# Altium schematic sheet LCD.SchDoc
size A4
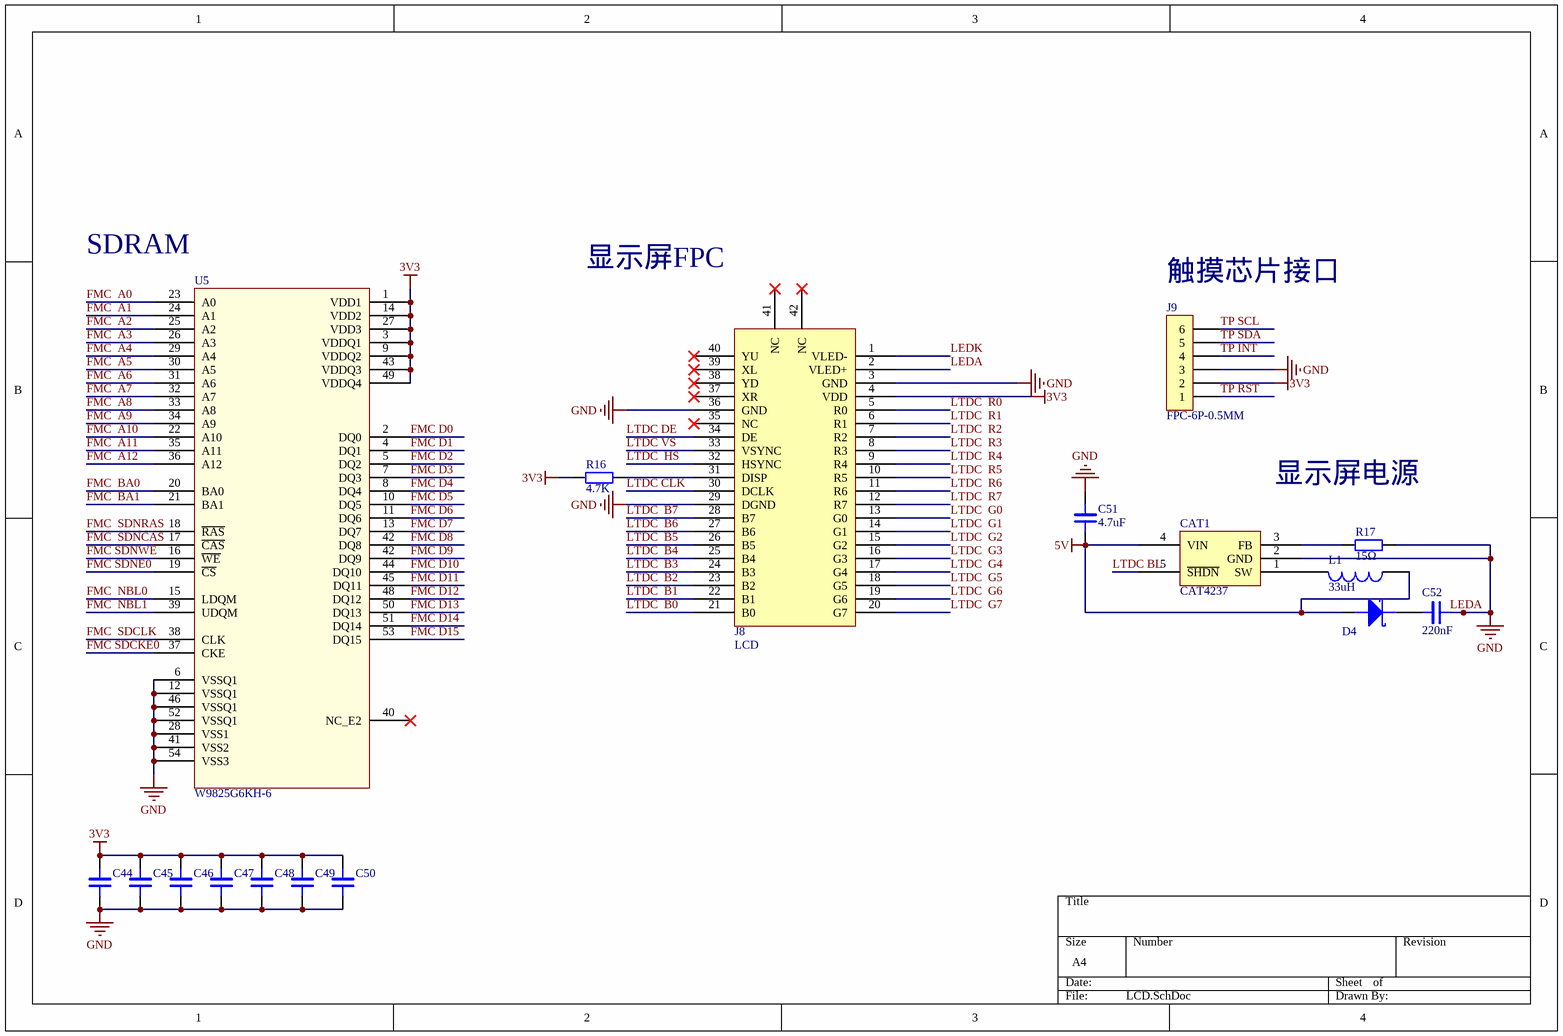
[diagram p0: LCD.SchDoc]

## Parts
C44  100nF 16V  [0805]  (value not drawn)
C45  100nF 16V  [0805]  (value not drawn)
C46  100nF 16V  [0805]  (value not drawn)
C47  100nF 16V  [0805]  (value not drawn)
C48  100nF 16V  [0805]  (value not drawn)
C49  100nF 16V  [0805]  (value not drawn)
C50  100nF 16V  [0805]  (value not drawn)
C51  4.7uF  [CAP-1812]
C52  220nF  [CAP-1812]
CAT1  CAT4237  [SOT-23-5]
D4  (no value)  [DO-15]
J8  LCD
J9  FPC-6P-0.5MM  [Pin HDR1X6/2.54mm-S]
L1  33uH  [AL0204]
R16  4.7K  [0805]
R17  15Ω  [0805]
U5  W9825G6KH-6

## Nets
3V3: C44.2 C45.2 C46.2 C47.2 C48.2 C49.2 C50.2 J8.4(VDD) J9.2 R16.1 U5.1(VDD1) U5.3(VDDQ1) U5.9(VDDQ2) U5.14(VDD2) U5.27(VDD3) U5.43(VDDQ3) U5.49(VDDQ4)
5V: C51.1 CAT1.4(VIN) D4.A L1.1
LEDA: C44.1 C45.1 C46.1 C47.1 C48.1 C49.1 C50.1 C51.2 C52.2 CAT1.2(GND) J8.2(VLED+) J8.3(GND) J8.29(DGND) J8.36(GND) J9.3 R17.2 U5.6(VSSQ1) U5.12(VSSQ1) U5.28(VSS1) U5.41(VSS2) U5.46(VSSQ1) U5.52(VSSQ1) U5.54(VSS3)  [also labelled GND]
FMC  A0: U5.23(A0)
FMC  A1: U5.24(A1)
FMC  A2: U5.25(A2)
FMC  A3: U5.26(A3)
FMC  A4: U5.29(A4)
FMC  A5: U5.30(A5)
FMC  A6: U5.31(A6)
FMC  A7: U5.32(A7)
FMC  A8: U5.33(A8)
FMC  A9: U5.34(A9)
FMC  A10: U5.22(A10)
FMC  A11: U5.35(A11)
FMC  A12: U5.36(A12)
FMC  BA0: U5.20(BA0)
FMC  BA1: U5.21(BA1)
FMC  NBL0: U5.15(LDQM)
FMC  NBL1: U5.39(UDQM)
FMC  SDCLK: U5.38(CLK)
FMC  SDNCAS: U5.17(~{CAS})
FMC  SDNRAS: U5.18(~{RAS})
FMC D0: U5.2(DQ0)
FMC D1: U5.4(DQ1)
FMC D2: U5.5(DQ2)
FMC D3: U5.7(DQ3)
FMC D4: U5.8(DQ4)
FMC D5: U5.10(DQ5)
FMC D6: U5.11(DQ6)
FMC D7: U5.13(DQ7)
FMC D8: U5.42(DQ8)
FMC D9: U5.42(DQ9)
FMC D10: U5.44(DQ10)
FMC D11: U5.45(DQ11)
FMC D12: U5.48(DQ12)
FMC D13: U5.50(DQ13)
FMC D14: U5.51(DQ14)
FMC D15: U5.53(DQ15)
FMC SDCKE0: U5.37(CKE)
FMC SDNE0: U5.19(~{CS})
FMC SDNWE: U5.16(~{WE})
LEDK: J8.1(VLED-)
LTDC  B0: J8.21(B0)
LTDC  B1: J8.22(B1)
LTDC  B2: J8.23(B2)
LTDC  B3: J8.24(B3)
LTDC  B4: J8.25(B4)
LTDC  B5: J8.26(B5)
LTDC  B6: J8.27(B6)
LTDC  B7: J8.28(B7)
LTDC  G0: J8.13(G0)
LTDC  G1: J8.14(G1)
LTDC  G2: J8.15(G2)
LTDC  G3: J8.16(G3)
LTDC  G4: J8.17(G4)
LTDC  G5: J8.18(G5)
LTDC  G6: J8.19(G6)
LTDC  G7: J8.20(G7)
LTDC  HS: J8.32(HSYNC)
LTDC  R0: J8.5(R0)
LTDC  R1: J8.6(R1)
LTDC  R2: J8.7(R2)
LTDC  R3: J8.8(R3)
LTDC  R4: J8.9(R4)
LTDC  R5: J8.10(R5)
LTDC  R6: J8.11(R6)
LTDC  R7: J8.12(R7)
LTDC BL: CAT1.5(~{SHDN})
LTDC CLK: J8.30(DCLK)
LTDC DE: J8.34(DE)
LTDC VS: J8.33(VSYNC)
TP INT: J9.4
TP RST: J9.1
TP SCL: J9.6
TP SDA: J9.5
NetC52_1: C52.1 D4.K
NetCAT1_1: CAT1.1(SW) L1.2
NetCAT1_3: CAT1.3(FB) R17.1
NetJ8_31: J8.31(DISP) R16.2

Not connected (* = marked no-connect by the designer): J8 35(NC)* 37(XR)* 38(YD)* 39(XL)* 40(YU)* 41(NC)* 42(NC)*; U5 40(NC_E2)*

## Notes on the sheet
- (near U5) SDRAM
- 显示屏FPC
- (near J9) 触摸芯片接口
- 显示屏电源

## Library data of the parts
C44-C52 = CAP: Capacitor
D4 = DIODE SCHOTTKY: 肖特基二极管
J8 = LCD: FPC 接线口0.5mm 40Pins
J9 = Pin HDR1X6
L1 = INDUCTOR
R16 R17 = RES: Resistor